# Altium schematic sheet 6 - Power.SchDoc
size Tabloid
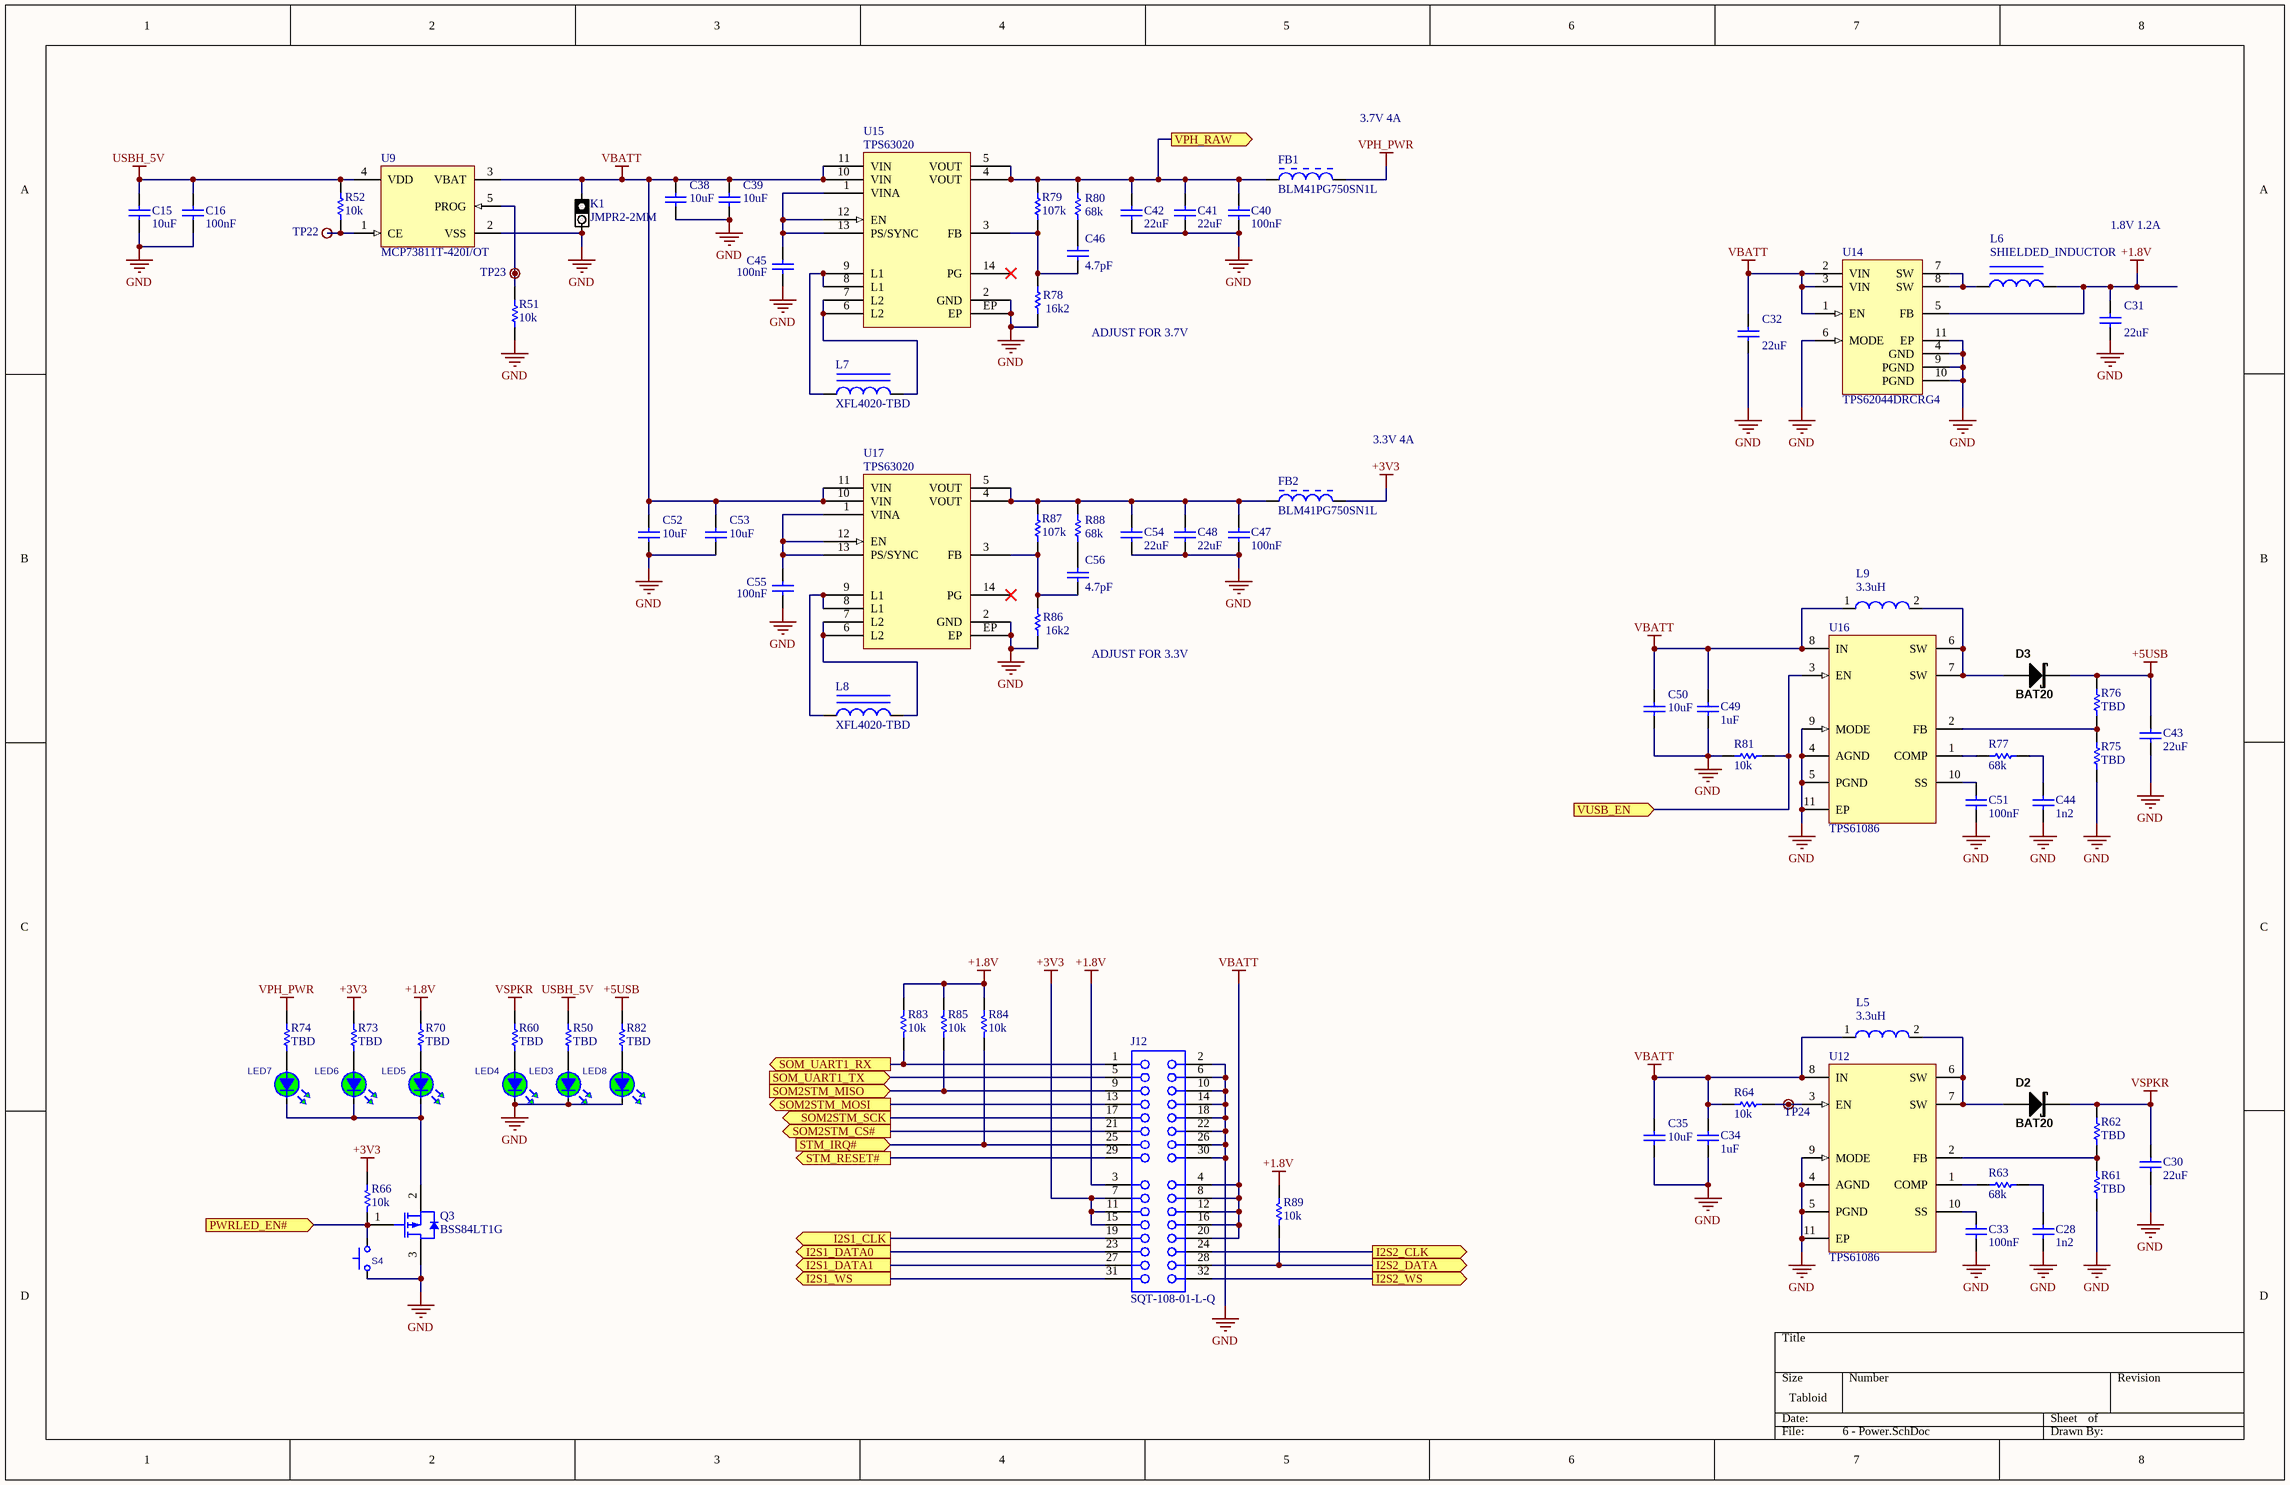
[diagram p0: 6 - Power.SchDoc]

## Parts
C15  value 10uF  [CAPC0805(2012)100_L]  (hidden comment: CAP 10uF 6.3V 0805(2012))
C16  value 100nF  [CAPC0805(2012)100_L]  (hidden comment: CAP 100nF 6.3V 0805(2012))
C28  value 1n2  [CAPC0805(2012)100_L]
C30  value 22uF  [CAPC0805(2012)145_L]  (hidden comment: CAP 22uF 16V 0805(2012))
C31  value 22uF  [CAPC0805(2012)100_L]  (hidden comment: CAP 22uF 4V 0805(2012))
C32  value 22uF  [CAPC0805(2012)100_L]  (hidden comment: CAP 22uF 4V 0805(2012))
C33  value 100nF  [CAPC0805(2012)100_L]  (hidden comment: CAP 100nF 6.3V 0805(2012))
C34  value 1uF  [CAPC0805(2012)100_L]
C35  value 10uF  [CAPC0805(2012)100_L]  (hidden comment: CAP 10uF 6.3V 0805(2012))
C38  value 10uF  [CAPC0805(2012)100_L]  (hidden comment: CAP 10uF 6.3V 0805(2012))
C39  value 10uF  [CAPC0805(2012)100_L]  (hidden comment: CAP 10uF 6.3V 0805(2012))
C40  value 100nF  [CAPC0805(2012)100_L]  (hidden comment: CAP 100nF 25V 0805(2012))
C41  value 22uF  [CAPC0805(2012)145_L]  (hidden comment: CAP 22uF 16V 0805(2012))
C42  value 22uF  [CAPC0805(2012)145_L]  (hidden comment: CAP 22uF 16V 0805(2012))
C43  value 22uF  [CAPC0805(2012)145_L]  (hidden comment: CAP 22uF 16V 0805(2012))
C44  value 1n2  [CAPC0805(2012)100_L]
C45  value 100nF  [CAPC0805(2012)100_L]  (hidden comment: CAP 100nF 6.3V 0805(2012))
C46  value 4.7pF  [CAPC0805(2012)100_L]  (hidden comment: CAP 4.7pF 10V 0805(2012))
C47  value 100nF  [CAPC0805(2012)100_L]  (hidden comment: CAP 100nF 25V 0805(2012))
C48  value 22uF  [CAPC0805(2012)145_L]  (hidden comment: CAP 22uF 16V 0805(2012))
C49  value 1uF  [CAPC0805(2012)100_L]
C50  value 10uF  [CAPC0805(2012)100_L]  (hidden comment: CAP 10uF 6.3V 0805(2012))
C51  value 100nF  [CAPC0805(2012)100_L]  (hidden comment: CAP 100nF 6.3V 0805(2012))
C52  value 10uF  [CAPC0805(2012)100_L]  (hidden comment: CAP 10uF 6.3V 0805(2012))
C53  value 10uF  [CAPC0805(2012)100_L]  (hidden comment: CAP 10uF 6.3V 0805(2012))
C54  value 22uF  [CAPC0805(2012)145_L]  (hidden comment: CAP 22uF 16V 0805(2012))
C55  value 100nF  [CAPC0805(2012)100_L]  (hidden comment: CAP 100nF 6.3V 0805(2012))
C56  value 4.7pF  [CAPC0805(2012)100_L]  (hidden comment: CAP 4.7pF 10V 0805(2012))
D2  BAT20  [SOD323]
D3  BAT20  [SOD323]
FB1  BLM41PG750SN1L  [MURA-BLM41-B35-CHIP-2_V2]
FB2  BLM41PG750SN1L  [MURA-BLM41-B35-CHIP-2_V2]
J12  SQT-108-01-L-Q  [SMTC-SQT-108-01-X-Q]
K1  JMPR2-2MM  [JMPR2-2MM]
L5  3.3uH  [SMD 0805_A]
L6  SHIELDED_INDUCTOR  [COILCRAFT_XFL4020]
L7  XFL4020-TBD  [COILCRAFT_XFL4020]
L8  XFL4020-TBD  [COILCRAFT_XFL4020]
L9  3.3uH  [SMD 0805_A]
LED3  VLMG1500-GS08  [LEDC0402(1005)_N-GRN]  (value not drawn)
LED4  VLMG1500-GS08  [LEDC0402(1005)_N-GRN]  (value not drawn)
LED5  VLMG1500-GS08  [LEDC0402(1005)_N-GRN]  (value not drawn)
LED6  VLMG1500-GS08  [LEDC0402(1005)_N-GRN]  (value not drawn)
LED7  VLMG1500-GS08  [LEDC0402(1005)_N-GRN]  (value not drawn)
LED8  VLMG1500-GS08  [LEDC0402(1005)_N-GRN]  (value not drawn)
Q3  BSS84LT1G  [ONSC-SOT-23-3-318-08_V]
R50  value TBD  [RESC0805(2012)_L]
R51  value 10k  [RESC0805(2012)_L]  (hidden comment: 10K 1% 0805(2012))
R52  value 10k  [RESC0805(2012)_L]  (hidden comment: 10K 1% 0805(2012))
R60  value TBD  [RESC0805(2012)_L]
R61  value TBD  [RESC0805(2012)_N]  (hidden comment: 20K 1% 0805(2012))
R62  value TBD  [RESC0805(2012)_N]  (hidden comment: 20K 1% 0805(2012))
R63  68k  [RESC0805(2012)_N]
R64  value 10k  [RESC0805(2012)_N]  (hidden comment: 20K 1% 0805(2012))
R66  value 10k  [RESC0805(2012)_L]  (hidden comment: 10K 1% 0805(2012))
R70  value TBD  [RESC0805(2012)_L]
R73  value TBD  [RESC0805(2012)_L]
R74  value TBD  [RESC0805(2012)_L]
R75  value TBD  [RESC0805(2012)_N]  (hidden comment: 20K 1% 0805(2012))
R76  value TBD  [RESC0805(2012)_N]  (hidden comment: 20K 1% 0805(2012))
R77  68k  [RESC0805(2012)_N]
R78  value 16k2  [RESC0805(2012)_L]  (hidden comment: 16K2 1% 0805(2012))
R79  value 107k  [RESC0805(2012)_L]
R80  value 68k  [RESC0805(2012)_L]  (hidden comment: 68K 5% 0805(2012))
R81  value 10k  [RESC0805(2012)_N]  (hidden comment: 20K 1% 0805(2012))
R82  value TBD  [RESC0805(2012)_L]
R83  value 10k  [RESC0805(2012)_L]  (hidden comment: 10K 1% 0805(2012))
R84  value 10k  [RESC0805(2012)_L]  (hidden comment: 10K 1% 0805(2012))
R85  value 10k  [RESC0805(2012)_L]  (hidden comment: 10K 1% 0805(2012))
R86  value 16k2  [RESC0805(2012)_L]  (hidden comment: 16K2 1% 0805(2012))
R87  value 107k  [RESC0805(2012)_L]
R88  value 68k  [RESC0805(2012)_L]  (hidden comment: 68K 5% 0805(2012))
R89  value 10k  [RESC0805(2012)_L]  (hidden comment: 10K 1% 0805(2012))
S4  KMR211GLFS  [KMR2]  (value not drawn)
TP22  Various test points  [VIAHOLE20]  (value not drawn)
TP23  Various test points  [VIAHOLE20]  (value not drawn)
TP24  Various test points  [TESTPOINT_035HOLE]  (value not drawn)
U9  MCP73811T-420I/OT  [SOT-23-OT5_M]
U12  TPS61086  [SON50P300X300X100-11T175X250N]
U14  TPS62044DRCRG4  [DRC10-2400X1650TP]
U15  TPS63020  [VSON14]
U16  TPS61086  [SON50P300X300X100-11T175X250N]
U17  TPS63020  [VSON14]

## Ports
I2S1_CLK (out), I2S1_DATA0 (out), I2S1_DATA1 (out), I2S1_WS (out), I2S2_CLK (out), I2S2_DATA (out), I2S2_WS (out), PWRLED_EN# (in), SOM2STM_CS# (out), SOM2STM_MISO (in), SOM2STM_MOSI (out), SOM2STM_SCK (out), SOM_UART1_RX (out), SOM_UART1_TX (in), STM_IRQ# (in), STM_RESET# (out), VPH_RAW (out), VUSB_EN (in)

## Nets
+1.8V: C31.2 J12.3 L6.2 R70.1 R83.2 R84.2 R85.2 R89.2 U14.5(FB)
+3V3: FB2.2 J12.7 J12.11 J12.15 R66.1 R73.1
+5USB: C43.2 D3.K R76.1 R82.1
GND: C15.1 C16.2 C28.1 C30.1 C31.1 C32.1 C33.1 C34.2 C35.1 C38.1 C39.1 C40.1 C41.1 C42.1 C43.1 C44.1 C45.2 C47.1 C48.1 C49.2 C50.1 C51.1 C52.1 C53.1 C54.1 C55.2 J12.2 J12.6 J12.10 J12.14 J12.18 J12.22 J12.26 J12.30 K1.2 LED3.K LED4.K LED8.K Q3.3(D) R51.1 R61.2 R75.2 R78.1 R81.2 R86.1 S4.1 U9.2(VSS) U12.4(AGND) U12.5(PGND) U12.9(MODE) U12.11(EP) U14.4(GND) U14.6(MODE) U14.9(PGND) U14.10(PGND) U14.11(EP) U15.2(GND) U15.EP U16.4(AGND) U16.5(PGND) U16.9(MODE) U16.11(EP) U17.2(GND) U17.EP
USBH_5V: C15.2 C16.1 R50.1 R52.1 U9.4(VDD)
VBATT: C32.2 C34.1 C35.2 C38.2 C39.2 C49.1 C50.2 C52.2 C53.2 J12.4 J12.8 J12.12 J12.16 J12.20 K1.1 L5.1 L9.1 R64.2 U9.3(VBAT) U12.8(IN) U14.1(EN) U14.2(VIN) U14.3(VIN) U15.10(VIN) U15.11(VIN) U16.8(IN) U17.10(VIN) U17.11(VIN)
VPH_PWR: FB1.2 R74.1
VSPKR: C30.2 D2.K R60.1 R62.1
I2S1_CLK: J12.19 ; port I2S1_CLK
I2S1_DATA0: J12.23 ; port I2S1_DATA0
I2S1_DATA1: J12.27 ; port I2S1_DATA1
I2S1_WS: J12.31 ; port I2S1_WS
I2S2_CLK: J12.24 ; port I2S2_CLK
I2S2_DATA: J12.28 R89.1 ; port I2S2_DATA
I2S2_WS: J12.32 ; port I2S2_WS
PWRLED_EN#: Q3.1(G) R66.2 S4.3 ; port PWRLED_EN#
SOM2STM_CS#: J12.21 ; port SOM2STM_CS#
SOM2STM_MISO: J12.9 R85.1 ; port SOM2STM_MISO
SOM2STM_MOSI: J12.13 ; port SOM2STM_MOSI
SOM2STM_SCK: J12.17 ; port SOM2STM_SCK
SOM_UART1_RX: J12.1 R83.1 ; port SOM_UART1_RX
SOM_UART1_TX: J12.5 ; port SOM_UART1_TX
STM_IRQ#: J12.25 R84.1 ; port STM_IRQ#
STM_RESET#: J12.29 ; port STM_RESET#
VPH_RAW: C40.2 C41.2 C42.2 FB1.1 R79.2 R80.2 U15.4(VOUT) U15.5(VOUT) ; port VPH_RAW
VUSB_EN: R81.1 U16.3(EN) ; port VUSB_EN
NetC28_2: C28.2 R63.1
NetC33_2: C33.2 U12.10(SS)
NetC44_2: C44.2 R77.1
NetC45_1: C45.1 U15.1(VINA) U15.12(EN) U15.13(PS/SYNC)
NetC46_1: C46.1 R78.2 R79.1 U15.3(FB)
NetC46_2: C46.2 R80.1
NetC47_2: C47.2 C48.2 C54.2 FB2.1 R87.2 R88.2 U17.4(VOUT) U17.5(VOUT)
NetC51_2: C51.2 U16.10(SS)
NetC55_1: C55.1 U17.1(VINA) U17.12(EN) U17.13(PS/SYNC)
NetC56_1: C56.1 R86.2 R87.1 U17.3(FB)
NetC56_2: C56.2 R88.1
NetD2_A: D2.A L5.2 U12.6(SW) U12.7(SW)
NetD3_A: D3.A L9.2 U16.6(SW) U16.7(SW)
NetL6_1: L6.1 U14.7(SW) U14.8(SW)
NetL7_1: L7.1 U15.8(L1) U15.9(L1)
NetL7_2: L7.2 U15.6(L2) U15.7(L2)
NetL8_1: L8.1 U17.8(L1) U17.9(L1)
NetL8_2: L8.2 U17.6(L2) U17.7(L2)
NetLED3_A: LED3.A R50.2
NetLED4_A: LED4.A R60.2
NetLED5_A: LED5.A R70.2
NetLED5_K: LED5.K LED6.K LED7.K Q3.2(S)
NetLED6_A: LED6.A R73.2
NetLED7_A: LED7.A R74.2
NetLED8_A: LED8.A R82.2
NetR51_2: R51.2 TP23.1 U9.5(PROG)
NetR52_2: R52.2 TP22.1 U9.1(CE)
NetR61_1: R61.1 R62.2 U12.2(FB)
NetR63_2: R63.2 U12.1(COMP)
NetR64_1: R64.1 TP24.1 U12.3(EN)
NetR75_1: R75.1 R76.2 U16.2(FB)
NetR77_2: R77.2 U16.1(COMP)

Not connected (* = marked no-connect by the designer): S4 2 4; U15 14(PG)*; U17 14(PG)*

## Notes on the sheet
- 3.7V 4A
- 1.8V 1.2A
- ADJUST FOR 3.7V
- 3.3V 4A
- ADJUST FOR 3.3V

## Library data of the parts
C15 C35 C50 = CMP-1036-04917-1: CAP 10uF 6.3V Â±10% 0805 (2012 Metric) Thickness 1mm SMD; Case-EIA: 0805; Case-Metric: 2012; Max Thickness: 1 mm; Tolerance: Â±10%; Technology: SMT; Rated Voltage: 6.3 V
C16 C33 C45 C51 C55 = CMP-1036-04391-1: CAP 100nF 6.3V Â±10% 0805 (2012 Metric) Thickness 1mm SMD; Case-EIA: 0805; Case-Metric: 2012; Rated Voltage: 6.3 V; Technology: SMT; Tolerance: Â±10%; Max Thickness: 1 mm
C28 C44 = CMP-1036-04391-1: Rated Voltage: 6.3 V; Case-EIA: 0805; Case-Metric: 2012; Tolerance: Â±10%; Technology: SMT; Max Thickness: 1 mm
C30 C41-C43 C48 C54 = CMP-1036-04946-1: CAP 22uF 16V Â±20% 0805 (2012 Metric) Thickness 1.45mm SMD; Case-Metric: 2012; Case-EIA: 0805; Tolerance: Â±20%; Max Thickness: 1.45 mm; Rated Voltage: 16 V; Technology: SMT
C31 C32 = CMP-1036-04937-1: CAP 22uF 4V Â±20% 0805 (2012 Metric) Thickness 1mm SMD; Case-Metric: 2012; Case-EIA: 0805; Technology: SMT; Rated Voltage: 4 V; Tolerance: Â±20%; Max Thickness: 1 mm
C34 C49 = CMP-1036-04917-1: Tolerance: Â±10%; Case-EIA: 0805; Rated Voltage: 6.3 V; Case-Metric: 2012; Max Thickness: 1 mm; Technology: SMT
C38 C39 C52 C53 = CMP-1036-04920-1: CAP 10uF 6.3V Â±20% 0805 (2012 Metric) Thickness 1mm SMD; Case-Metric: 2012; Case-EIA: 0805; Max Thickness: 1 mm; Tolerance: Â±20%; Rated Voltage: 6.3 V; Technology: SMT
C40 C47 = CMP-1036-04411-1: CAP 100nF 25V Â±10% 0805 (2012 Metric) Thickness 1mm SMD; Case-EIA: 0805; Case-Metric: 2012; Max Thickness: 1 mm; Rated Voltage: 25 V; Technology: SMT; Tolerance: Â±10%
C46 C56 = CMP-1036-00526-1: CAP 4.7pF 10V Â±0.25pF 0805 (2012 Metric) Thickness 1mm SMD; Case-Metric: 2012; Case-EIA: 0805; Tolerance: Â±0.25pF; Rated Voltage: 10 V; Max Thickness: 1 mm; Technology: SMT
D2 D3 = BAT20-SOD323: Schottky Diode SOD323 1A 23V; Supplier 1: Digi-Key; Supplier Part Number 1: 497-3381-2-ND
FB1 FB2 = CMP-0686-00749-2: Chip Ferrite Bead for Power Lines, 75 Ohm, 3500 mA, -55 to 125 degC, 4.5 x 1.6 x 1.8 mm SMD, Tape and Reel; Manufacturer: Murata; Rated Current: 3500 mA; Impedance (at 100 MHz): 75 Ohm Typ.; DC Resistance: 0.015 Ohm Max.; PackageReference: BLM41-2; Packing: Tape and Reel; PartNumber: BLM41PG750SN1L; ComponentLink1URL: http://www.murata.com/; ComponentLink3Description: Package Specification; ComponentLink1Description: Manufacturer URL; ComponentLink3URL: http://www.murata.com/products/catalog/pdf/c31e.pdf; DatasheetVersion: 08/2013; PackageDescription: 2-Pin Chip, Body 4.5 x 1.6 mm; Operating Temperature Range: -55 to 125 degC; Mounting Technology: Surface Mount; ComponentLink2URL: http://www.murata.com/products/catalog/pdf/c31e.pdf; ComponentLink2Description: Datasheet
J12 = CMP-1021-00092-1: Cost-Effective Rugged Socket, Through-hole, Vertical, -55 to 125 degC, 2 mm Pitch, 32-Pin, Female, RoHS; Manufacturer: Samtec; Pitch: 2 mm; Mounting Technology: Through-hole; ComponentLink3URL: http://www.samtec.com/documents/webfiles/cpdf/SQT-1XX-XX-XXX-X-XXX-XXX-MKT.pdf; ComponentLink1URL: http://www.samtec.com; RoHS: True; DatasheetVersion: F-214; ComponentLink1Description: Manufacturer URL; PartNumber: SQT-108-01-L-Q; PackageReference: SQT-108-01-X-Q; PackageDescription: 2mm Socket Strip Assembly; ComponentLink2URL: http://www.samtec.com/documents/webfiles/pdf/SQT_TH.PDF; Orientation: Vertical; ComponentLink3Description: Package Specification; PackageVersion: BY, 7/1995; ComponentLink2Description: Datasheet; Temperature Range: -55 to 125 degC
K1 = JMPR2-2MM: JMPR2 2MM OPEN BY DEFAULT; Manufacturer: Sullins Connector Solutions; Manufacturer Part Number: PBC36SAAN; Supplier 1: Digi-Key; Supplier Part Number 1: S1011E-36-ND; Reel: Open
L5 L9 = CMP-1392-00033-1: Power Multilayer Inductor WE-PMI, L=1.00 ÂµH; Manufacturer: Wuerth Elektronik; ComponentLink1URL: http://www.we-online.com; PackageReference: SMD 0805_A; ComponentLink1Description: Manufacturer URL; ComponentLink2Description: Datasheet; ComponentLink2URL: http://katalog.we-online.de/kataloge/eisos/media/pdf/74479775210A.pdf
L7 L8 = SHIELDED_INDUCTOR
LED3-LED8 = LED_0402_VLMG1500-GS08: LED GREEN 0402 SMD; Manufacturer: Vishay Semiconductor Opto Division; Wavelength - Dominant: 571nm; Wavelength - Peak: 574nm; Millicandela Rating: 35mcd; Voltage - Forward (Vf) (Typ): 2V; Current - Test: 20mA; Viewing Angle: 130°; Lens Style/Size: Rectangle with Flat Top, 1.00mm x 0.50mm; Supplier 1: Digi-Key; Manufacturer Part Number: VLMG1500-GS08; RoHS: RoHS Compliant; Category: Optoelectronics; Stock 1: 37065; Pricing 1: 1=0.52, 10=0.384, 25=0.3072, 100=0.2035, 250=0.144, 500=0.12288, 750=0.10368, 1000=0.096 (USD); Packaging: Cut Tape (CT); Color: Green; Lens Transparency: -; Lens Color: -; Package / Case: 0402 (1005 Metric); Supplier Device Package: 0402; Size / Dimension: 1.00mm L x 0.50mm W; Height (Max): 0.35mm; Mounting Type: Surface Mount; ComponentLink1URL: http://www.vishay.com/docs/82554/vlmo1500.pdf; ComponentLink1Description: http://www.vishay.com/docs/82554/vlmo1500.pdf; Supplier Part Number 1: VLMG1500-GS08CT-ND
Q3 = CMP-1058-00762-1: Power MOSFET Single P-Channel, -50 V, 10 Ohm, 3-Pin SOT-23, Pb-Free, Tape and Reel; Manufacturer: On Semiconductor; Ciss Typ (pF): 36; ID Max (A): 0.13; Channel Polarity: P Channel; VGS(th) Max (V): 2; VGS Max (V): 20; V(BR)DSS Min (V): 50; Crss Typ (pF): 6.5; PD Max (W): 0.225; Coss Typ (pF): 17; Configuration: Single; Mounting Technology: Surface Mount; ComponentLink3URL: http://www.onsemi.cn/pub_link/Collateral/318-08.PDF; ComponentLink1Description: Manufacturer URL; Package Type: SOT-23-3; ComponentLink2URL: http://www.onsemi.com/pub_link/Collateral/BSS84LT1-D.PDF; RoHS: Pb-Free; Packing: Tape and Reel; ComponentLink1URL: http://www.onsemi.com/; PackageVersion: Rev. AP, 11/2009; PackageReference: SOT-23-3-318-08; PackageDescription: 3-Pin Small Outline Transistor, Body 2.92 x 1.3 mm, Pitch 0.95 mm; DatasheetVersion: Rev. 8; ComponentLink3Description: Package Specification; PartNumber: BSS84LT1G; ComponentLink2Description: Datasheet
R50-R52 R60 R66 R70 R73 R74 R82-R85 R89 = CMP-1013-00623-1: 10K 0.125W 1% 0805 (2012 Metric)  SMD; Case-Metric: 2012; Case-EIA: 0805; Tolerance: 1 %; Power: 0.125 W; Technology: SMT
R61 R62 R64 R75 R76 R81 = CMP-1013-00655-1: 20K 0.125W 1% 0805 (2012 Metric)  SMD; Case-EIA: 0805; Case-Metric: 2012; Power: 0.125 W; Tolerance: 1 %; Technology: SMT
R63 R77 = CMP-1013-00655-1: Power: 0.125 W; Tolerance: 1 %; Case-EIA: 0805; Case-Metric: 2012; Technology: SMT; Value: 68k
R78 R86 = CMP-1013-00645-1: 16K2 0.125W 1% 0805 (2012 Metric)  SMD; Case-Metric: 2012; Case-EIA: 0805; Tolerance: 1 %; Technology: SMT; Power: 0.125 W
R79 R87 = CMP-1013-00645-1: Case-Metric: 2012; Case-EIA: 0805; Tolerance: 1 %; Power: 0.125 W; Technology: SMT
R80 R88 = CMP-1013-00118-1: 68K 0.125W 5% 0805 (2012 Metric)  SMD; Case-EIA: 0805; Case-Metric: 2012; Technology: SMT; Power: 0.125 W; Tolerance: 5 %
S4 = SW_KMR211G LFS: SWITCH TACTILE SPST-NO 0.05A 32V; Manufacturer: C&K Components; Switch Function: Off-Mom; Contact Rating @ Voltage: 0.05A @ 32VDC; Actuator Type: Standard; Actuator Height off PCB, from Pins: 1.90mm; Actuator Orientation: Top Actuated; Outline: 4.60mm x 2.80mm; Illumination: Non-Illuminated; Operating Force: 120gf; Switch Travel: 0.20mm; Mechanical Life: 200,000 Cycles; Supplier 1: Digi-Key; Manufacturer Part Number: KMR211GLFS; RoHS: RoHS Compliant; Category: Switches; Stock 1: 4378; Pricing 1: 1=0.51, 10=0.493, 25=0.484, 50=0.4656, 100=0.4017, 250=0.3652, 500=0.34694, 1000=0.2739 (USD); Packaging: Cut Tape (CT); Circuit: SPST-NO; Mounting Type: Surface Mount; Termination Style: Gull Wing; Illumination Voltage (Nominal): -; Illumination Type, Color: -; Ingress Protection: -; Features: Grounding Pin; Actuator Material: -; Operating Temperature: -40°C ~ 85°C; ComponentLink1URL: http://www.ck-components.com/index.php?module=media&action=Display&cmpref=14414&lang=en&width=&height=&format=&alt=; ComponentLink1Description: http://www.ck-components.com/index.php?module=media&action=Display&cmpref=14414&lang=en&width=&height=&format=&alt=; Supplier Part Number 1: 401-1426-1-ND
TP22-TP24 = TESTPOINTHOLE035
U9 = CMP-0133-00139-1: Simple, Miniature Single-Cell, Fully Integrated Li-Ion/Li-Polymer Charge Management Controller, 4.2V, 5-Pin SOT-23, Industrial Temperature, Tape and Reel; Code_IPC: SOT23-5; PackageDescription: 5-Lead Plastic Small Outline Transistor (OT) [SOT-23]; PackageVersion: revBB, Aug-2009; DatasheetVersion: revB, Sep-2007; PackageReference: SOT-23-OT5
U14 = CMP-0323-00557-1: Buck Step Down Regulator with 2.5 to 6 V Input and 1.8 V Output, -40 to 85 degC, 10-Pin SON (DRC), Green (RoHS & no Sb/Br); Manufacturer: Texas Instruments; Vin(Max)(V): 6; SubFamily: Step-Down Regulator; Iq(Typ)(mA): 0.018; Rating: Catalog; Preset Vout(V): 1.8; Iout(Max)(A): 1.2; Regulated Outputs(#): 1; Duty Cycle(Max)(%): 100; Switch Current Limit(Typ)(A): 2; Vin(Min)(V): 2.5; ComponentLink2Description: Package Specification; ComponentLink3URL: Samples URL:http://www.ti.com/product/tps54611#samples; Topology: Buck; ComponentLink2URL: http://www.ti.com/litv/pdf/mpds117k; PartNumber: TPS62044DRCRG4; ComponentLink1Description: Datasheet; ComponentLink1URL: http://www.ti.com/general/docs/lit/getliterature.tsp?genericPartNumber=TPS62044&fileType=pdf; PackageReference: DRC10-2400X1650TP; Mounting Technology: Surface Mount; ComponentLink3Description: URL Link1; PackageDescription: 10-Pin Plastic Small Outline No-Lead, 3 x 3 x 1 mm Body, 0.5 mm Pitch, Exposed Pad; Eco-Plan: Green (RoHS & no Sb/Br); Vout(Min)(V): 1.8; PackageVersion: revL, Sep-2011; DatasheetVersion: SLVS463B; Vout(Max)(V): 1.8
U15 U17 = TPS63020: pin to pad: EP>15